# Altium schematic sheet USB_OTG_HS.SchDoc: USB OTG HS PHY with micro A-B connector
size A4; Date: 29-OCT-2015; Author: A.B; CompanyName: STMicroelectronics; Organization: MCD/TOOLS/GNB; Address1: 12, Rue Jules HOROWITZ; Address2: 38019 Grenoble; Address3: FRANCE; DocumentNumber: MB1225; Revision: B-01; SheetNumber: 9; SheetTotal: 13; Project: STM32F769I-DISCO
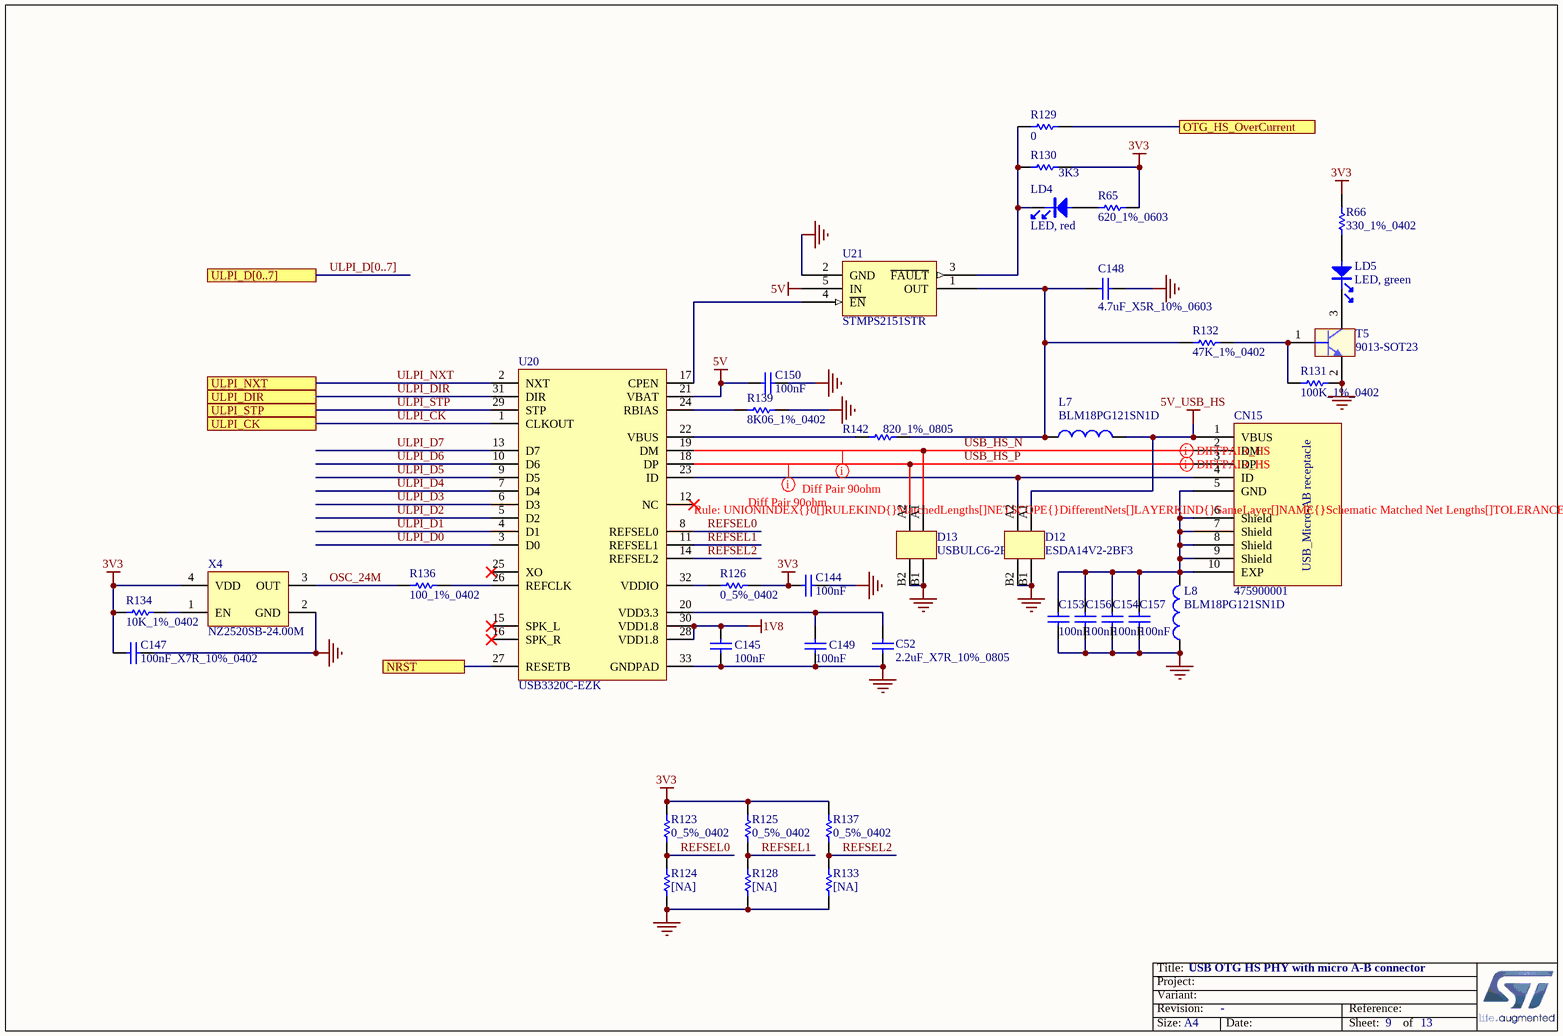
[diagram p0: USB_OTG_HS.SchDoc]

## Parts
C52  2.2uF_X7R_10%_0805  [TAN-A]
C144  100nF  [0402C]
C145  100nF  [0402C]
C147  100nF_X7R_10%_0402  [0402C]
C148  4.7uF_X5R_10%_0603  [0603C]
C149  100nF  [0402C]
C150  100nF  [0402C]
C153  100nF  [0402C]
C154  100nF  [0402C]
C156  100nF  [0402C]
C157  100nF  [0402C]
CN15  475900001  [MOLEX_47590001]
D12  ESDA14V2-2BF3  [BGA4_0R4_0R8X0R8]
D13  USBULC6-2F3  [BGA4_0R4_0R8X0R8]
L7  BLM18PG121SN1D  [0603L]
L8  BLM18PG121SN1D  [0603L]
LD4  LED, red  [0603D]
LD5  LED, green  [0603D]
R65  620_1%_0603  [0603R]
R66  330_1%_0402  [0402R]
R123  0_5%_0402  [0402R]
R124  [NA]  [0402R]
R125  0_5%_0402  [0402R]
R126  0_5%_0402  [0402R]
R128  [NA]  [0402R]
R129  0  [0402R]
R130  3K3  [0402R]
R131  100K_1%_0402  [0402R]
R132  47K_1%_0402  [0402R]
R133  [NA]  [0402R]
R134  10K_1%_0402  [0402R]
R136  100_1%_0402  [0402R]
R137  0_5%_0402  [0402R]
R139  8K06_1%_0402  [0402R]
R142  820_1%_0805  [0805R]
T5  9013-SOT23  [SOT-23]
U20  USB3320C-EZK  [QFN32_0R5_5X5]
U21  STMPS2151STR  [SOT23-5]
X4  NZ2520SB-24.00M  [OSC_4SM_2R5X2]

## Ports
NRST, OTG_HS_OverCurrent, ULPI_CK, ULPI_D[0..7], ULPI_DIR, ULPI_NXT, ULPI_STP

## Nets
1V8: C145.2 U20.28(VDD1.8) U20.30(VDD1.8)
3V3: C144.1 C147.1 R65.2 R66.2 R123.2 R125.2 R126.2 R130.1 R134.1 R137.2 X4.4(VDD)
5V: C150.1 U20.21(VBAT) U21.5(IN)
5V_USB_HS: CN15.1(VBUS) D12.A1 L7.2
GND: C52.1 C144.2 C145.1 C147.2 C148.2 C149.1 C150.2 C153.1 C154.1 C156.1 C157.1 D12.B1 D12.B2 D13.B1 D13.B2 L8.1 R124.1 R128.1 R131.2 R133.1 R139.2 T5.2(E) U20.33(GNDPAD) U21.2(GND) X4.2(GND)
NRST: U20.27(RESETB) ; port NRST
OSC_24M: R136.1 X4.3(OUT)
OTG_HS_OverCurrent: R129.2 ; port OTG_HS_OverCurrent
REFSEL0: R123.1 R124.2 U20.8(REFSEL0)
REFSEL1: R125.1 R128.2 U20.11(REFSEL1)
REFSEL2: R133.2 R137.1 U20.14(REFSEL2)
ULPI_CK: U20.1(CLKOUT) ; port ULPI_CK
ULPI_D0: U20.3(D0)
ULPI_D1: U20.4(D1)
ULPI_D2: U20.5(D2)
ULPI_D3: U20.6(D3)
ULPI_D4: U20.7(D4)
ULPI_D5: U20.9(D5)
ULPI_D6: U20.10(D6)
ULPI_D7: U20.13(D7)
ULPI_DIR: U20.31(DIR) ; port ULPI_DIR
ULPI_NXT: U20.2(NXT) ; port ULPI_NXT
ULPI_STP: U20.29(STP) ; port ULPI_STP
USB_HS_N: CN15.2(DM) D13.A1 U20.19(DM)
USB_HS_P: CN15.3(DP) D13.A2 U20.18(DP)
NetC52_2: C52.2 C149.2 U20.20(VDD3.3)
NetC148_1: C148.1 L7.1 R132.1 R142.2 U21.1(OUT)
NetC153_2: C153.2 C154.2 C156.2 C157.2 CN15.5(GND) CN15.6(Shield) CN15.7(Shield) CN15.8(Shield) CN15.9(Shield) CN15.10(EXP) L8.2
NetCN15_4: CN15.4(ID) D12.A2 U20.23(ID)
NetLD4_1: LD4.1 R65.1
NetLD4_2: LD4.2 R129.1 R130.2 U21.3(~{FAULT})
NetLD5_1: LD5.1 R66.1
NetLD5_2: LD5.2 T5.3(C)
NetR126_1: R126.1 U20.32(VDDIO)
NetR131_1: R131.1 R132.2 T5.1(B)
NetR134_2: R134.2 X4.1(EN)
NetR136_2: R136.2 U20.26(REFCLK)
NetR139_1: R139.1 U20.24(RBIAS)
NetR142_1: R142.1 U20.22(VBUS)
NetU20_17: U20.17(CPEN) U21.4(~{EN})

Not connected (* = marked no-connect by the designer): U20 12(NC)* 15(SPK_L)* 16(SPK_R)* 25(XO)*

## Buses and harness runs
bus ULPI_D[0..7] = port ULPI_D[0..7]

## Layout directives
differential pair: USB_HS_N, USB_HS_P
rule Matched Net Lengths [Tolerance = 150mil]: USB_HS_N, USB_HS_P

## Notes on the sheet
- Title:
- Project:
- Size:
- Revision:
- Variant:
- A4
- -
- Date:
- Reference:
- Sheet:
- of
- (in symbol 475900001) USB_Micro-AB receptacle

## Library data of the parts
C52 = Cap_2.2uF_X7R_10%_0805: Capacitor,2.2uF,16V, X7R,10%,0805,YAGEO; Manuf_Part_1: CC0805KKX7R7BB225; Revision: July-2002: Re-released for DXP Platform.; Value: 2.2uF; Order: CC0805KKX7R7BB225; Manuf_1: YAGEO; ECCN_US/EU: n/a
C144 C145 C147 C149 C150 C153 C154 C156 C157 = Cap_100nF_X7R_10%_0402: Capacitor,100nF,16V,X7R,10%,0402,YAGEO; Manuf_Part_1: CC0402KRX7R7BB104; Revision: July-2002: Re-released for DXP Platform.; Value: 100nF; Order: CC0402KRX7R7BB104; Manuf_1: YAGEO
  C147: ECCN_US/EU: n/a
C148 = Cap_4.7uF_X5R_10%_0603: Capacitor,4.7uF,16V, X5R,10%,0603,YAGEO; Manuf_Part_1: CC0603KRX5R7BB475; Order: CC0603KRX5R7BB105; Revision: July-2002: Re-released for DXP Platform.; Value: 4.7uF; Manuf_1: YAGEO; ECCN_US/EU: n/a
CN15 = 475900001: USB-MICRO-AB, 47590-0001, SMT, MOLEX; Manuf_Part_1: 47590-0001; Manuf_1: MOLEX; ECCN_US/EU: n/a
D12 = ESDA14V2-2BF3: Quad bidirectional Transil array for ESD protection; Manuf_1: STM; ECCN_US/EU: EAR99/NEC; Provided: ST; Ref St: 9179040; Distrib: ST; Manuf_Part_1: ESDA14V2-2BF3
D13 = USBULC6-2F3: 2-line Transil, (TVS), ultralow capacitance protection for high speed USB; Manuf_1: STM; ECCN_US/EU: EAR99/NEC; Ref St: 9151090; Provided: ST; Manuf_Part_1: USBULC6-2F3; Distrib: ST
L7 L8 = BEAD_120R_2A_0603: Bead,120R,2A,0603,BLM18PG121SN1D,MURATA; Manuf_Part_3: FCM1608KF-601T03; Manuf_2: TDK; Manuf_Part_2: MPZ1608S300A; Manuf_3: Tai-tech; Value: 100uH; Description_3: Bead,600R,350mA,0603,FCM1608KF-601T03,Tai-tech; Description_2: Bead,30R,5A,0603,MPZ1608S300A,TDK; Revision: July-2002: Re-released for DXP Platform.; ECCN_US/EU: n/a; Manuf_Part_1: BLM18PG121SN1D; Manuf_1: MURATA
LD4 = LED_red: LED, red, 0603; Manuf_1: everlight; Manuf_Part_1: 19-213-R6C-AP1Q2B/3T; ECCN_US/EU: EAR99/NEC; Order: 19-213-R6C-AP1Q2B/3T
LD5 = LED_green: LED, green, 0603; Manuf_1: everlight; Manuf_Part_1: 19-213SYGC/S530-E2/TR8; ECCN_US/EU: EAR99/NEC; Order: 19-213SYGC/S530-E2/TR8
R65 = Res_620_1%_0603: Resistor,620,0603,1%,VISHAY; Manuf_Part_1: CRCW0603620RFKEA; Manuf_1: VISHAY DRALORIC; Value: 620; Order: 2122341; ECCN_US/EU: n/a; Distrib: FARNELL
R66 = Res_330_1%_0402: Resistor,330,0402,1%,YAGEO; Manuf_Part_1: RC0402FR-07330RL; Value: 330; ECCN_US/EU: n/a; Manuf_1: YAGEO; Distrib: DIGIKEY; Order: RC0402FR-07330RL
R123 R125 R126 R137 = Res_0_5%_0402: Resistor,0,0402,5%,YAGEO; Manuf_Part_1: RC0402JR-070RL; Value: 0; Order: 2363467; ECCN_US/EU: n/a; Manuf_1: YAGEO; Distrib: FARNELL
R124 R128 R133 = Res_NA_0402: Resistor,[NA],0402; Fitted: NO; Value: [NA]; ECCN_US/EU: n/a
R129 = Res_0_5%_0402: Resistor,0,0402,5%,YAGEO; Manuf_Part_1: RC0402JR-070RL; Order: 2363467; Value: 0; ECCN_US/EU: n/a; Manuf_1: YAGEO; Distrib: FARNELL
R130 = Res_3K3_1%_0402: Resistor,3K3,0402,1%,YAGEO; Manuf_Part_1: RC0402FR-073K3L; Value: 3K3; Manuf_1: YAGEO; Order: *; ECCN_US/EU: n/a; Distrib: FARNELL
R131 = Res_100K_1%_0402: Resistor,100K,0402,1%,YAGEO; Manuf_Part_1: RC0402FR-07100KL; Manuf_Part_2: RT0402FRE07100KL; Value: 100K; Manuf_1: YAGEO; ECCN_US/EU: n/a; Manuf_2: YAGEO
R132 = Res_47K_1%_0402: Resistor,47K,0402,1%,YAGEO; Manuf_Part_1: RC0402FR-0747KL; Order: 9239430; Value: 47K; Manuf_1: YAGEO; ECCN_US/EU: n/a; Distrib: FARNELL
R134 = Res_10K_1%_0402: Resistor,10K,0402,1%,YAGEO; Manuf_Part_1: RC0402FR-0710KL; Value: 10K; Manuf_1: YAGEO; Order: RC0402FR-0710KL; ECCN_US/EU: n/a
R136 = Res_100_1%_0402: Resistor,100,0402,1%,YAGEO; Manuf_Part_1: RC0402FR-07100RL; Value: 100; Order: 9239111; Manuf_1: YAGEO; ECCN_US/EU: n/a; Distrib: FARNELL
R139 = Res_8K06_1%_0402: Resistor,8K06,0402,1%,YAGEO; Manuf_Part_1: RC0402FR-078K06L; Value: 8K06; Manuf_1: YAGEO; Order: RC0402FR-078K06L; ECCN_US/EU: n/a; Distrib: DIGIKEY
R142 = Res_820_1%_0805: Resistor,820,0805,1%,YAGEO; Manuf_Part_1: RC0805FR-07820RL; Value: 820; Manuf_1: YAGEO; Order: RC0805FR-07820RL; ECCN_US/EU: n/a
T5 = 9013-SOT23: NPN Bipolar Transistor; Manuf_1: NXP; Manuf_Part_1: BSR14; Order: 1081310; ECCN_US/EU: EAR99/NEC; Revision: July-2002: Re-released for DXP Platform.; Distrib: FARNELL
U20 = USB3320C-EZK: USB3320C,  Hi-Speed USB Host, Device or OTG PHY with ULPI Low Pin Interface; Manuf_1: MICROCHIP; Manuf_Part_1: USB3320C-EZK-TR; ECCN_US/EU: EAR99/NEC; Provided: Sub Co; Distrib: MICROCHIP; Order: USB3320C-EZK-TR
U21 = STMPS2151STR: Enhanced single channel power switches; Manuf_1: STM; Provided: ST; ECCN_US/EU: EAR99/NEC; Ref St: xxxxxx; Order: STMPS2151STR; Manuf_Part_1: STMPS2151STR; Distrib: ST
X4 = OSC_24M_NZ2520SB: Oscillator 24.00Mhz, -+50PPM, 3.3V, Temp -55 to +125°C; Manuf_Part_2: KC2520B24.0000C10E00; Manuf_1: NDK; Manuf_Part_1: NZ2520SB 24MHz END4869A; Manuf_2: AVX Corp/Kyocera Corp; ECCN_US/EU: EAR99/NEC; Ref St: 9157032; Provided: ST; Order: *